# EAGLE design MoteinoM0_HeaderLayout (EAGLE 7.7.0)
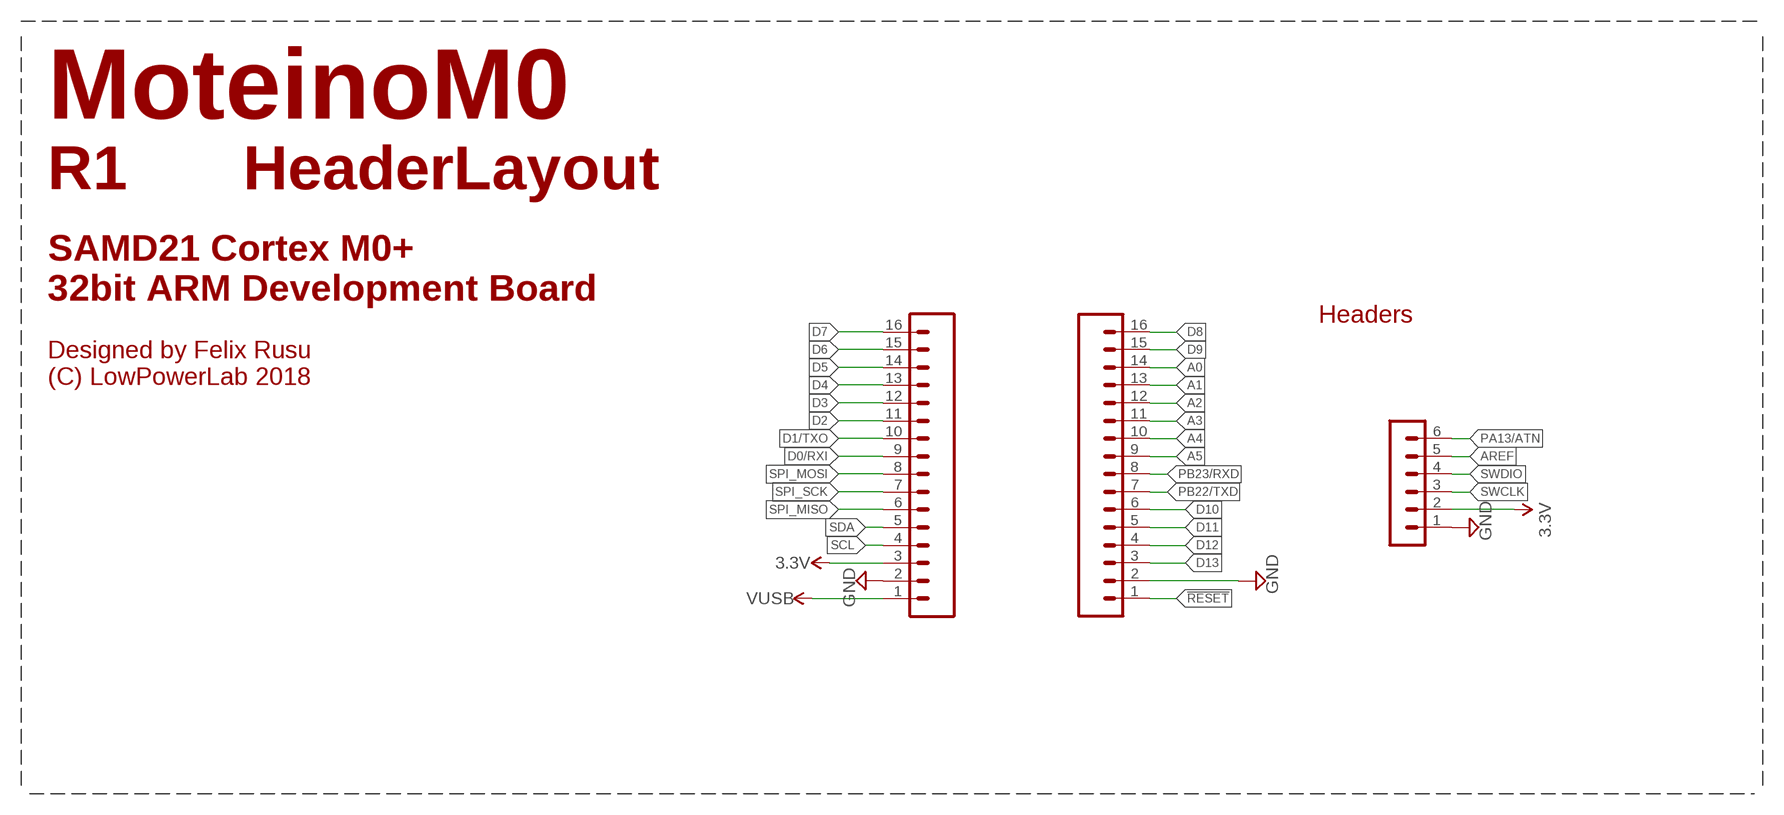
[diagram p0: schematic, sheet 1]

## Parts
U$2  HDR_16PINHH  [1X16_THINRINGS_HH]
U$4  HDR_16PINHH  [1X16_THINRINGS_HH]
U$10  HDR_6PINHH  [1X06_NS_THINRINGS_HH]

## Nets
3.3V: U$4.3
3.3V_: U$10.2 ; supply symbol labelled 3.3V
!RESET: U$2.1
A0: U$2.14
A1: U$2.13
A2: U$2.12
A3: U$2.11
A4: U$2.10
A5: U$2.9
AREF: U$10.5
D0/RXI: U$4.9
D1/TXO: U$4.10
D2: U$4.11
D3: U$4.12
D4: U$4.13
D5: U$4.14
D6: U$4.15
D7: U$4.16
D8: U$2.16
D9: U$2.15
D10: U$2.6
D11: U$2.5
D12: U$2.4
D13: U$2.3
GND: U$2.2 U$4.2 U$10.1
PA13/ATN: U$10.6
PB22/TXD: U$2.7
PB23/RXD: U$2.8
SCL: U$4.4
SDA: U$4.5
SPI_MISO: U$4.6
SPI_MOSI: U$4.8
SPI_SCK: U$4.7
SWCLK: U$10.3
SWDIO: U$10.4
VUSB: U$4.1

## Notes on the sheet
- MoteinoM0
- R1 | HeaderLayout
- SAMD21 Cortex M0+
  32bit ARM Development Board
- Headers
- Designed by Felix Rusu
- (C) LowPowerLab 2018

## Library data of the parts
U$2 U$4 = LowPowerLab:HDR_16PIN
U$10 = LowPowerLab:HDR_6PIN

## Net classes
1 power: width 0.381 mm, clearance 0.254 mm

## Board
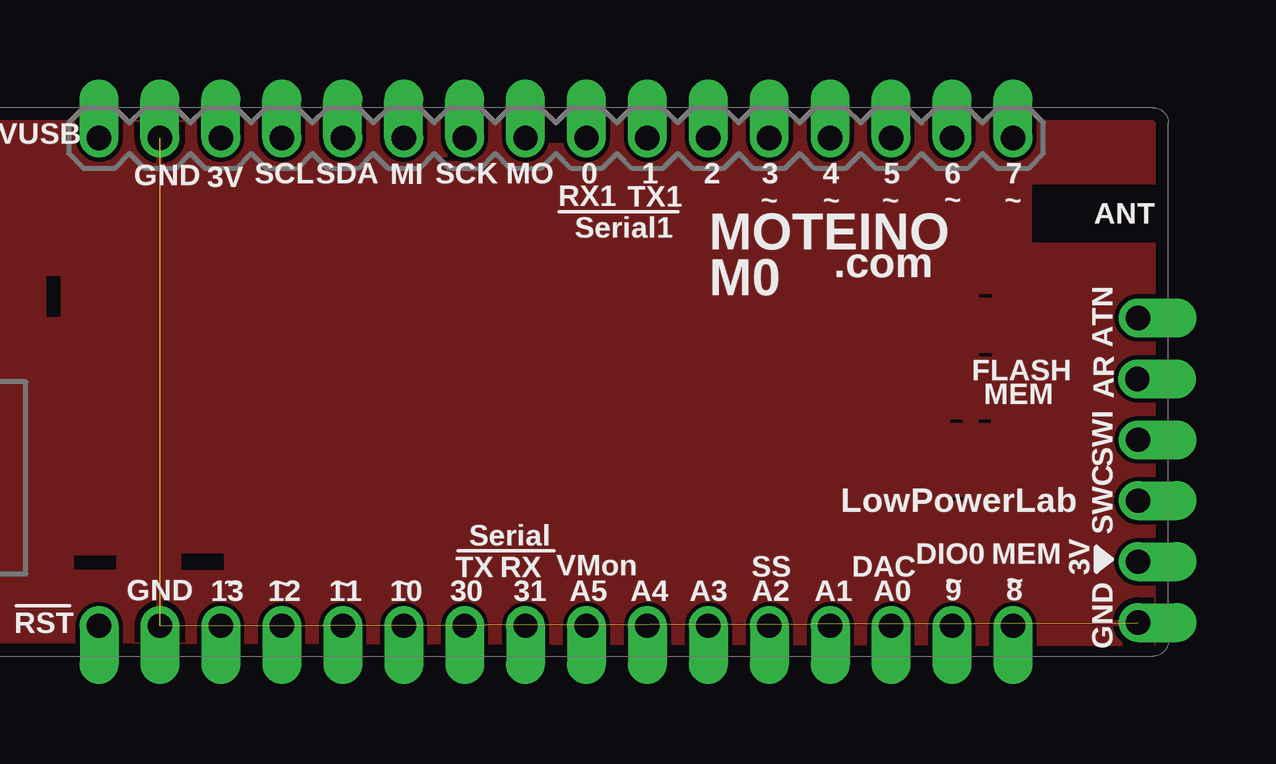
[diagram p1: board, top side]
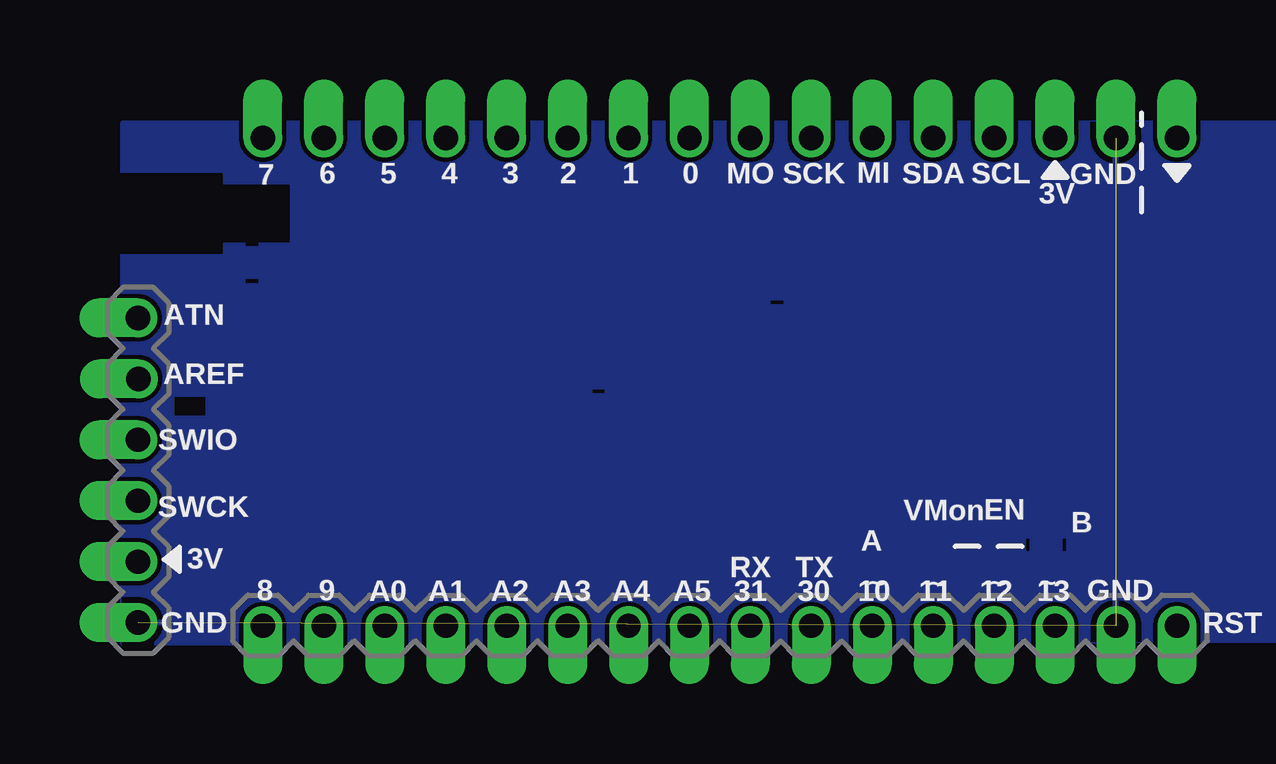
[diagram p2: board, bottom side, seen from below]

No outline drawn. Coordinates in mm, seen from the top.
Copper layers (1*16): Top 0.035mm / dielectric 1.5mm / Bottom 0.035mm
Design rules "Gold_Phoenix_Standard_Spec_2_layer *": minimum track width 6mil, minimum drill 6mil, track to track 7mil, track to pad 8mil, pad to pad 6mil, via to via 6mil, smd to smd 0mil, copper to edge 18mil, drill to drill 8mil, minimum pad ring 5mil, minimum via ring 5mil, stop-mask expansion 3mil, vias tented up to drill 20mil, thermal gap 10mil
tRestrict: area 43.1,15.7 to 43.6,15.8; area 43.1,13.3 to 43.6,13.4; area 46.1,18 to 50.3,20.4; area 25.1,22.1 to 25.7,22.3; area 20.7,21.4 to 21.2,21.5; area 41.9,7.3 to 42.4,7.4; area 43,10.5 to 43.5,10.6; area 41.8,10.5 to 42.3,10.6; area 45.3,18 to 49.4,20.4; area 5.3,4.4 to 7.1,5; area 9.8,4.4 to 11.6,5; area 4.2,14.9 to 4.7,16.6
bRestrict: area 30.2,11.7 to 30.7,11.9; area 22.8,15.4 to 23.3,15.6; area 46.1,17.5 to 50.3,20.9; area 44.7,17.9 to 45.2,18; area 43.3,18 to 47.5,20.4; area 46.9,10.8 to 48.1,11.6; area 44.7,16.3 to 45.2,16.5; area 11,5.2 to 11.1,5.7; area 12.5,5.2 to 12.6,5.7

### Footprints (pad centres in the part's own frame; a part is rotated, then mirrored left to right if it is on the bottom)
1X16_THINRINGS_HH = drill 1.016 pad 1.626 offset: 1 0,0; 2 2.54,0; 3 5.08,0; 4 7.62,0; 5 10.16,0; 6 12.7,0; 7 15.24,0; 8 17.78,0; 9 20.32,0; 10 22.86,0; 11 25.4,0; 12 27.94,0; 13 30.48,0; 14 33.02,0; 15 35.56,0; 16 38.1,0
1X06_NS_THINRINGS_HH = drill 1.016 pad 1.626 offset: 1 0,0; 2 2.54,0; 3 5.08,0; 4 7.62,0; 5 10.16,-0.025; 6 12.7,0

### Placement (x,y rotation side)
U$2  6.35,2.03 180 bottom
U$4  6.35,22.35 0 top
U$10  49.66,2.16 90 bottom

### Tracks (layer width: path | path; a pad name or v marks a point on that pad's centre or on a via)
GND  (2 unrouted)
  pour Bottom: 0.13,22.99 0.13,1.4 50.29,1.27 50.29,22.99
  pour Top: 0.13,22.99 0.13,1.4 50.29,1.27 50.29,22.99

### Text on the board
tPlace: VUSB | 2 | 3 | 4 | 5 | 6 | 7 | GND | 3V | SCL | SDA | MI | SCK | MO | RX1 | 0 | 1 | ~ | ~ | ~ | ~ | ~ | ANT | TX1 | Serial1 | MOTEINO | .com | M0 | ATN | FLASH | MEM | AR | SWI | LowPowerLab | SWC | Serial | DIO0 | MEM | 3V | ~ | ~ | ~ | ~ | TX | RX | VMon | SS | DAC | ~ | ~ | GND | 13 | 12 | 11 | 10 | 30 | 31 | A5 | A4 | A3 | A2 | A1 | A0 | 9 | 8 | RST | GND
bPlace: GND | SCL | SDA | MI | SCK | MO | 0 | 1 | 3V | 2 | 3 | 4 | 5 | 6 | 7 | ATN | AREF | SWIO | EN | VMon | SWCK | B | A | TX | RX | GND | 13 | 12 | 11 | 10 | 30 | 31 | A5 | A4 | A3 | A2 | A1 | A0 | 9 | 8 | 3V | ~ | ~ | ~ | ~ | RST | GND
tStop: M0
bStop: R1
tDocu: USB